# Altium project Simple_EEM_Controller.PrjPCB (part 2 of 5)

## Sheet Connector_EEM.SchDoc: =SheetTitle_Top
size 420 x 297 mm; EDA_Number: ARTIQ; Projet: Simple EEM Controller; Author: G.Kasprowicz; CompanyName: WUT ISE; DrawnBy: G.Kasprowicz; Organization: WUT ISE; Address1: PW ISE; Address2: Nowowiejska 15/19 00-665 Warsaw; Address3: gkasprow@gmail.com; Revision: 1.0; ModifiedBy: -; CheckedDate: -; Title2: EEM Connectors; DivGrp: WUT ISE; Designer: G.Kasprowicz; ModifiedDate: -; ProjectName: Sensor Box
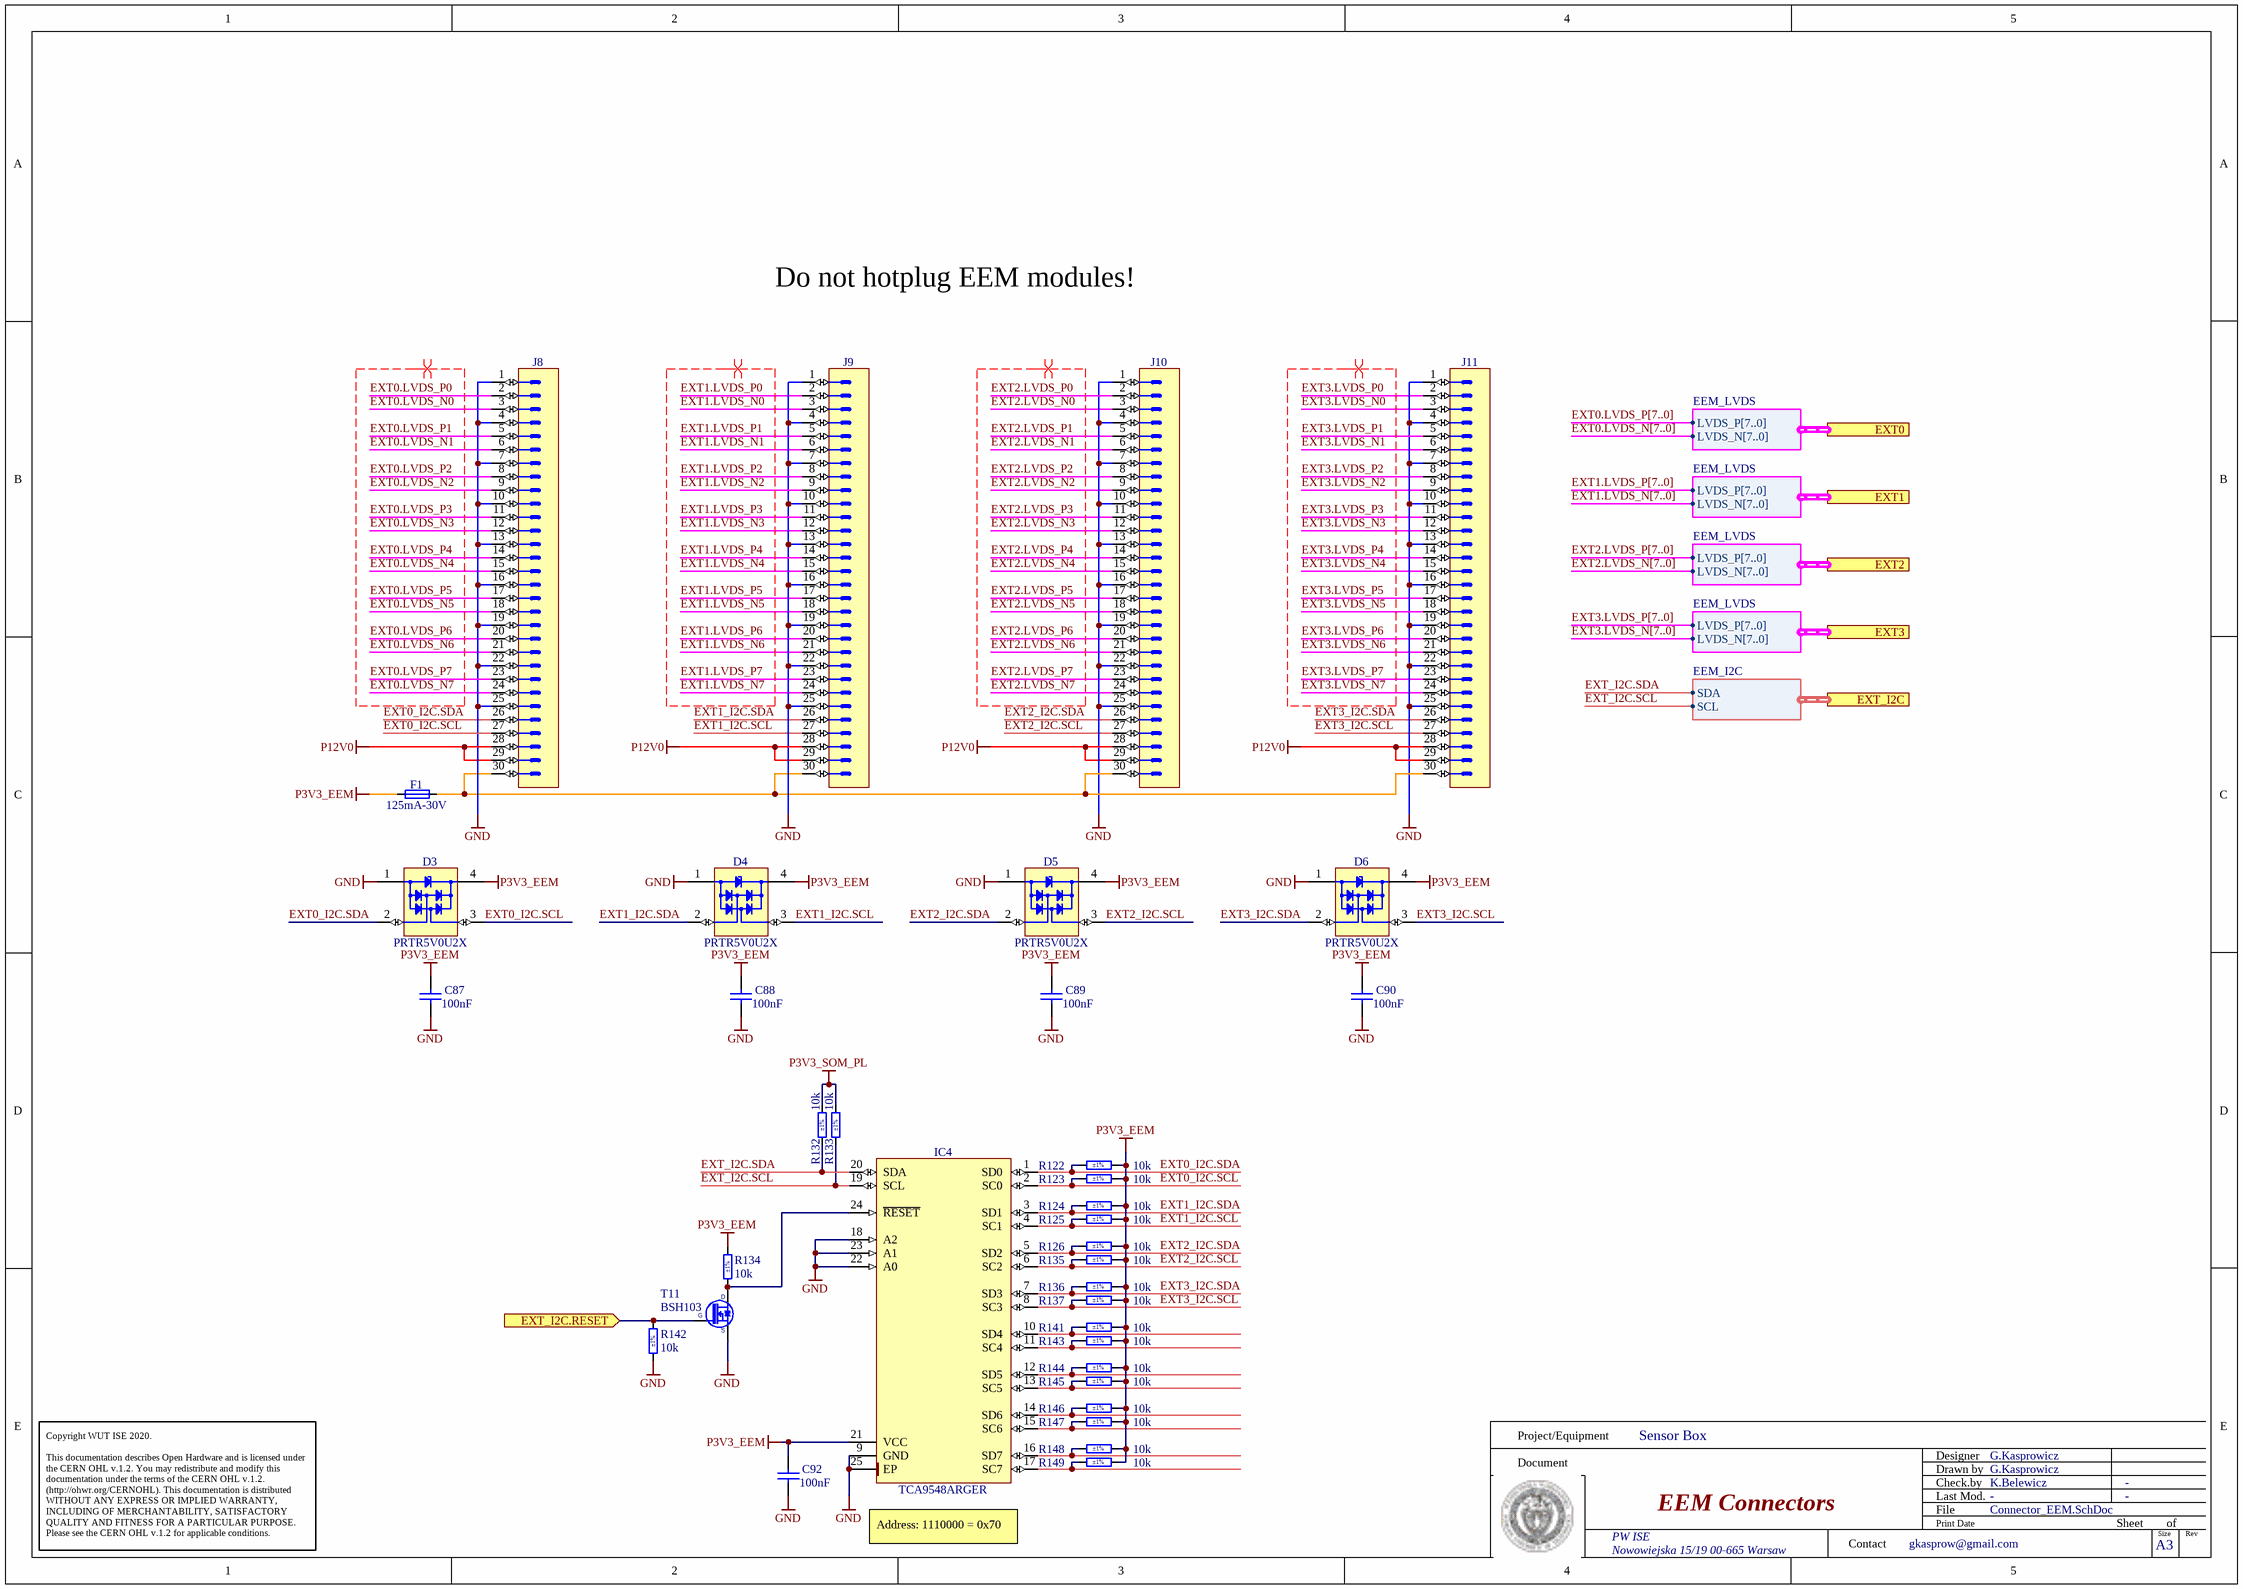
[diagram p3: Connector_EEM.SchDoc]

### Parts
C87  100nF  [CAPC1005X55N]
C88  100nF  [CAPC1005X55N]
C89  100nF  [CAPC1005X55N]
C90  100nF  [CAPC1005X55N]
C92  100nF  [CAPC1005X55N]
D3  PRTR5V0U2X  [SOT190P230X110-4N]
D4  PRTR5V0U2X  [SOT190P230X110-4N]
D5  PRTR5V0U2X  [SOT190P230X110-4N]
D6  PRTR5V0U2X  [SOT190P230X110-4N]
F1  125mA-30V  [FUSR_LITTELFUSE_1206L012]
IC4  TCA9548ARGER  [QFN50P400X400X100-25N-S220]
J8  (no value)  [3M_N2530-6002RB]
J9  (no value)  [3M_N2530-6002RB]
J10  (no value)  [3M_N2530-6002RB]
J11  (no value)  [3M_N2530-6002RB]
R122  10k  Tolerance: ±1%  [RESC1005X40N]
R123  10k  Tolerance: ±1%  [RESC1005X40N]
R124  10k  Tolerance: ±1%  [RESC1005X40N]
R125  10k  Tolerance: ±1%  [RESC1005X40N]
R126  10k  Tolerance: ±1%  [RESC1005X40N]
R132  10k  Tolerance: ±1%  [RESC1005X40N]
R133  10k  Tolerance: ±1%  [RESC1005X40N]
R134  10k  Tolerance: ±1%  [RESC1005X40N]
R135  10k  Tolerance: ±1%  [RESC1005X40N]
R136  10k  Tolerance: ±1%  [RESC1005X40N]
R137  10k  Tolerance: ±1%  [RESC1005X40N]
R141  10k  Tolerance: ±1%  [RESC1005X40N]
R142  10k  Tolerance: ±1%  [RESC1005X40N]
R143  10k  Tolerance: ±1%  [RESC1005X40N]
R144  10k  Tolerance: ±1%  [RESC1005X40N]
R145  10k  Tolerance: ±1%  [RESC1005X40N]
R146  10k  Tolerance: ±1%  [RESC1005X40N]
R147  10k  Tolerance: ±1%  [RESC1005X40N]
R148  10k  Tolerance: ±1%  [RESC1005X40N]
R149  10k  Tolerance: ±1%  [RESC1005X40N]
T11  BSH103  [SOT95P230X110-3N]

### Ports
EXT0 (harness EEM_LVDS), EXT1 (harness EEM_LVDS), EXT2 (harness EEM_LVDS), EXT3 (harness EEM_LVDS), EXT_I2C (harness EEM_I2C), EXT_I2C.RESET (in)

### Harnesses
EEM_LVDS: LVDS_N[7..0], LVDS_P[7..0]
EEM_I2C: SCL, SDA

### Nets
GND: C87.1 C88.1 C89.1 C90.1 C92.1 D3.1(GND) D4.1(GND) D5.1(GND) D6.1(GND) IC4.9(GND) IC4.18(A2) IC4.22(A0) IC4.23(A1) IC4.25(EP) J8.1 J8.4 J8.7 J8.10 J8.13 J8.16 J8.19 J8.22 J8.25 J9.1 J9.4 J9.7 J9.10 J9.13 J9.16 J9.19 J9.22 J9.25 J10.1 J10.4 J10.7 J10.10 J10.13 J10.16 J10.19 J10.22 J10.25 J11.1 J11.4 J11.7 J11.10 J11.13 J11.16 J11.19 J11.22 J11.25 R142.1 T11.2(S)
P3V3_EEM: C87.2 C88.2 C89.2 C90.2 C92.2 D3.4(VCC) D4.4(VCC) D5.4(VCC) D6.4(VCC) F1.1 IC4.21(VCC) R122.2 R123.2 R124.2 R125.2 R126.2 R134.2 R135.2 R136.2 R137.2 R141.2 R143.2 R144.2 R145.2 R146.2 R147.2 R148.2 R149.2
P3V3_SOM_PL: R132.2 R133.2
P12V0: J8.28 J8.29 J9.28 J9.29 J10.28 J10.29 J11.28 J11.29
EXT0.LVDS_N0: J8.3
EXT0.LVDS_N1: J8.6
EXT0.LVDS_N2: J8.9
EXT0.LVDS_N3: J8.12
EXT0.LVDS_N4: J8.15
EXT0.LVDS_N5: J8.18
EXT0.LVDS_N6: J8.21
EXT0.LVDS_N7: J8.24
EXT0.LVDS_P0: J8.2
EXT0.LVDS_P1: J8.5
EXT0.LVDS_P2: J8.8
EXT0.LVDS_P3: J8.11
EXT0.LVDS_P4: J8.14
EXT0.LVDS_P5: J8.17
EXT0.LVDS_P6: J8.20
EXT0.LVDS_P7: J8.23
EXT0_I2C.SCL: D3.3(I/O2) IC4.2(SC0) J8.27 R123.1
EXT0_I2C.SDA: D3.2(I/O1) IC4.1(SD0) J8.26 R122.1
EXT1.LVDS_N0: J9.3
EXT1.LVDS_N1: J9.6
EXT1.LVDS_N2: J9.9
EXT1.LVDS_N3: J9.12
EXT1.LVDS_N4: J9.15
EXT1.LVDS_N5: J9.18
EXT1.LVDS_N6: J9.21
EXT1.LVDS_N7: J9.24
EXT1.LVDS_P0: J9.2
EXT1.LVDS_P1: J9.5
EXT1.LVDS_P2: J9.8
EXT1.LVDS_P3: J9.11
EXT1.LVDS_P4: J9.14
EXT1.LVDS_P5: J9.17
EXT1.LVDS_P6: J9.20
EXT1.LVDS_P7: J9.23
EXT1_I2C.SCL: D4.3(I/O2) IC4.4(SC1) J9.27 R125.1
EXT1_I2C.SDA: D4.2(I/O1) IC4.3(SD1) J9.26 R124.1
EXT2.LVDS_N0: J10.3
EXT2.LVDS_N1: J10.6
EXT2.LVDS_N2: J10.9
EXT2.LVDS_N3: J10.12
EXT2.LVDS_N4: J10.15
EXT2.LVDS_N5: J10.18
EXT2.LVDS_N6: J10.21
EXT2.LVDS_N7: J10.24
EXT2.LVDS_P0: J10.2
EXT2.LVDS_P1: J10.5
EXT2.LVDS_P2: J10.8
EXT2.LVDS_P3: J10.11
EXT2.LVDS_P4: J10.14
EXT2.LVDS_P5: J10.17
EXT2.LVDS_P6: J10.20
EXT2.LVDS_P7: J10.23
EXT2_I2C.SCL: D5.3(I/O2) IC4.6(SC2) J10.27 R135.1
EXT2_I2C.SDA: D5.2(I/O1) IC4.5(SD2) J10.26 R126.1
EXT3.LVDS_N0: J11.3
EXT3.LVDS_N1: J11.6
EXT3.LVDS_N2: J11.9
EXT3.LVDS_N3: J11.12
EXT3.LVDS_N4: J11.15
EXT3.LVDS_N5: J11.18
EXT3.LVDS_N6: J11.21
EXT3.LVDS_N7: J11.24
EXT3.LVDS_P0: J11.2
EXT3.LVDS_P1: J11.5
EXT3.LVDS_P2: J11.8
EXT3.LVDS_P3: J11.11
EXT3.LVDS_P4: J11.14
EXT3.LVDS_P5: J11.17
EXT3.LVDS_P6: J11.20
EXT3.LVDS_P7: J11.23
EXT3_I2C.SCL: D6.3(I/O2) IC4.8(SC3) J11.27 R137.1
EXT3_I2C.SDA: D6.2(I/O1) IC4.7(SD3) J11.26 R136.1
EXT_I2C.RESET: R142.2 T11.1(G) ; port EXT_I2C.RESET
EXT_I2C.SCL: IC4.19(SCL) R133.1 ; port EXT_I2C.SCL
EXT_I2C.SDA: IC4.20(SDA) R132.1 ; port EXT_I2C.SDA
NetF1_2: F1.2 J8.30 J9.30 J10.30 J11.30
NetIC4_10: IC4.10(SD4) R141.1
NetIC4_11: IC4.11(SC4) R143.1
NetIC4_12: IC4.12(SD5) R144.1
NetIC4_13: IC4.13(SC5) R145.1
NetIC4_14: IC4.14(SD6) R146.1
NetIC4_15: IC4.15(SC6) R147.1
NetIC4_16: IC4.16(SD7) R148.1
NetIC4_17: IC4.17(SC7) R149.1
NetIC4_24: IC4.24(~{RESET}) R134.1 T11.3(D)

### Buses and harness runs
bus EXT0.LVDS_N[7..0]
bus EXT0.LVDS_P[7..0]
bus EXT1.LVDS_N[7..0]
bus EXT1.LVDS_P[7..0]
bus EXT2.LVDS_N[7..0]
bus EXT2.LVDS_P[7..0]
bus EXT3.LVDS_N[7..0]
bus EXT3.LVDS_P[7..0]

### Layout directives
differential pair: EXT0.LVDS_N0, EXT0.LVDS_N1, EXT0.LVDS_N2, EXT0.LVDS_N3, EXT0.LVDS_N4, EXT0.LVDS_N5, EXT0.LVDS_N6, EXT0.LVDS_N7, EXT0.LVDS_P0, EXT0.LVDS_P1, EXT0.LVDS_P2, EXT0.LVDS_P3, EXT0.LVDS_P4, EXT0.LVDS_P5, EXT0.LVDS_P6, EXT0.LVDS_P7, EXT1.LVDS_N0, EXT1.LVDS_N1, EXT1.LVDS_N2, EXT1.LVDS_N3, EXT1.LVDS_N4, EXT1.LVDS_N5, EXT1.LVDS_N6, EXT1.LVDS_N7, EXT1.LVDS_P0, EXT1.LVDS_P1, EXT1.LVDS_P2, EXT1.LVDS_P3, EXT1.LVDS_P4, EXT1.LVDS_P5, EXT1.LVDS_P6, EXT1.LVDS_P7, EXT2.LVDS_N0, EXT2.LVDS_N1, EXT2.LVDS_N2, EXT2.LVDS_N3, EXT2.LVDS_N4, EXT2.LVDS_N5, EXT2.LVDS_N6, EXT2.LVDS_N7, EXT2.LVDS_P0, EXT2.LVDS_P1, EXT2.LVDS_P2, EXT2.LVDS_P3, EXT2.LVDS_P4, EXT2.LVDS_P5, EXT2.LVDS_P6, EXT2.LVDS_P7, EXT3.LVDS_N0, EXT3.LVDS_N1, EXT3.LVDS_N2, EXT3.LVDS_N3, EXT3.LVDS_N4, EXT3.LVDS_N5, EXT3.LVDS_N6, EXT3.LVDS_N7, EXT3.LVDS_P0, EXT3.LVDS_P1, EXT3.LVDS_P2, EXT3.LVDS_P3, EXT3.LVDS_P4, EXT3.LVDS_P5, EXT3.LVDS_P6, EXT3.LVDS_P7

### Notes on the sheet
- Do not hotplug EEM modules!
- (near IC4) Address: 1110000 = 0x70
- Project/Equipment
- Document
- Designer
- Drawn by
- Check.by
- Copyright WUT ISE 2020.
  This documentation describes Open Hardware and is licensed under the CERN OHL v.1.2. You may redistribute and modify this documentation under the terms of the CERN OHL v.1.2. (http://ohwr.org/CERNOHL). This documentation is distributed WITHOUT ANY EXPRESS OR IMPLIED WARRANTY, INCLUDING OF MERCHANTABILITY, SATISFACTORY QUALITY AND FITNESS FOR A PARTICULAR PURPOSE. Please see the CERN OHL v.1.2 for applicable conditions.
- Contact
- File
- Last Mod.
- Print Date
- Sheet
- Size
- A3
- of
- Rev

### Library data of the parts
C87-C90 C92 = CC0402_100NF_16V_10%_X5R: Non-polarised capacitor; Part Description: SMD Multilayer Chip Ceramic Capacitor; Manufacturer: GENERIC; Manufacturer1 Part Number: GRM155R61C104KA88D; Voltage: 16V; TC: X5R; Tolerance: ±10%; Part Number: CC0402_100NF_16V_10%_X5R; Component Kind: Standard; Component Type: Standard; Pin Count: 2; Value: 100nF; Status: None; Manufacturer Part Number: CC0402_100NF_16V_10%_X5R; Case: 0402; Mounted: Yes; Socket: No; SMD: Yes; Sense: No; Manufacturer1 Example: MURATA; Manufacturer1 ComponentHeight: 0.55mm; HelpURL: \\cern.ch\dfs\Applications\Altium\Datasheets\CC0402_X5R_MURATA_GRM.pdf; Author: CERN DEM JLC; CreateDate: 10.12.2013; LatestRevisionDate: 10.12.2013
D3-D6 = PRTR5V0U2X: Ultra Low Capacitance Double Rail-to-Rail ESD Protection Diode; Part Description: Ultra Low Capacitance (1pF) Double Rail-to-Rail ESD Protection Diode (8kV); Manufacturer: NXP SEMICONDUCTORS; Voltage: 5.5V; PressFit: No; Bonding: No; Part Number: PRTR5V0U2X; Component Kind: Standard; Component Type: Standard; Device: PRTR5V0U2X; PackageDescription: SOT143B, SOT, 1.90mm Pitch; 4 Pin, 1.30mm W X 2.90mm L X 1.10mm H body, IPC Medium Density; Manufacturer Part Number: PRTR5V0U2X; Pin Count: 4; Case: SOT143B; Mounted: Yes; Socket: No; SMD: Yes; Sense: No; ComponentHeight: 1.1mm; HelpURL: \\cern.ch\dfs\Applications\Altium\Datasheets\PRTR5V0U2X.pdf; Author: CERN DEM JLC; CreateDate: 22.03.2011; LatestRevisionDate: 22.03.2011
F1 = FUSR_LITTELFUSE_1206L012: Fuse; Part Description: POLYFUSE® Surface Mount Resettable PTC; Manufacturer Part Number: 1206L012WR; PressFit: No; Part Number: FUSR_LITTELFUSE_1206L012; Component Kind: Standard; Component Type: Standard; Pin Count: 2; PackageDescription: Surface Mount POLY-FUSE® Resettable PTC, 1206L Series; Family: Fuses Resettable; Mounted: Yes; Socket: No; SMD: Yes; Sense: No; Value: 125mA-30V; Manufacturer: LITTELFUSE; ComponentHeight: 1.45mm; HelpURL: \\cern.ch\dfs\Applications\Altium\Datasheets\FUSR_LITTELFUSE_1206L012.pdf; Author: CERN DEM JLC; CreateDate: 19.12.2011; LatestRevisionDate: 19.12.2011
IC4 = TCA9548ARGER: Low Voltage 8-Channel I2C Switch With Reset; Manufacturer: TEXAS INSTRUMENTS; PressFit: No; Bonding: No; Part Number: TCA9548ARGER; Component Kind: Standard; Component Type: Standard; Device: TCA9548ARGER; PackageDescription: QFN, 0.50mm Pitch, Square; 24 Pin, 4.00mm L X 4.00mm W X 1.00mm H body (w/thermal tab 2.2 X 2.2mm), IPC Medium Density; Part Description: Low Voltage 8-Channel I2C Switch With Reset; Manufacturer Part Number: TCA9548ARGER; Pin Count: 25; Case: QFN24; Mounted: Yes; Socket: No; SMD: Yes; Sense: No; ComponentHeight: 1mm; Author: CERN DEM JLC; HelpURL: \\cern.ch\dfs\Applications\Altium\Datasheets\TCA9548ARGER.pdf; CreateDate: 07.07.2014; LatestRevisionDate: 07.07.2014
J8-J11 = 3M_N2530-6002RB: Connector 30 Male; Part Description: 30 Contacts - Straight .100'' x .100'' Low Profile Four-Wall Header, 2500 Series; Manufacturer: 3M; PressFit: No; Part Number: 3M_N2530-6002RB; Component Kind: Standard; Component Type: Standard; Pin Count: 30; Family: Header 30; Mounted: Yes; Socket: No; SMD: No; Sense: No; Status: None; Manufacturer Part Number: N2530-6002RB; ComponentHeight: 10.03mm; HelpURL: \\cern.ch\dfs\Applications\Altium\Datasheets\3M_N2530-6002RB.pdf; Author: CERN DEM JLC; CreateDate: 11.02.2009; LatestRevisionDate: 11.08.2009
R122-R126 R132-R137 R141-R149 = R0402_10K_1%_0.0625W_100PPM: Resistor - 1%; Part Description: General Purpose Thick Film Chip Resistor; Manufacturer: GENERIC; Manufacturer1 Part Number: 232270671003L; TC: ±100ppm/°C; PressFit: No; Part Number: R0402_10K_1%_0.0625W_100PPM; Component Kind: Standard; Component Type: Standard; Pin Count: 2; Value: 10k; Status: Not Recommended; Power: 0.0625W; Manufacturer Part Number: R0402_10K_1%_0.0625W_100PPM; Case: 0402; Mounted: Yes; Sense: No; Socket: No; SMD: Yes; Manufacturer1 Example: YAGEO PHYCOMP; Manufacturer1 ComponentHeight: 0.4mm; HelpURL: \\cern.ch\dfs\Applications\Altium\Datasheets\R0402_Phycomp_RC0402.pdf; Author: CERN DEM JLC; CreateDate: 03.12.2007; LatestRevisionDate: 17.10.2012
T11 = BSH103: N-CHANNEL MOSFET WITH DIODE; Part Description: 30V 850mA N-Channel Enhancement Mode Field-Effect Transistor; Manufacturer: NEXPERIA; PressFit: No; Bonding: No; Part Number: BSH103; Component Kind: Standard; Component Type: Standard; Device: BSH103; PackageDescription: SOT23, 3 pin, Pitch 0.95mm - 1.3mm W X 2.9mm L X 1.1mm H, IPC Medium Density; Manufacturer Part Number: BSH103; Pin Count: 3; Case: SOT23-3; Mounted: Yes; Socket: No; SMD: Yes; Sense: No; ComponentHeight: 1.1mm; HelpURL: \\cern.ch\dfs\Applications\Altium\Datasheets\BSH103.pdf; Author: CERN DEM JLC; CreateDate: 16.03.2010; LatestRevisionDate: 20.06.2017; ClassName: Artix

## Sheet SOM.SchDoc: =SheetTitle_Top
size 420 x 297 mm; EDA_Number: ARTIQ; Projet: Simple EEM Controller; Author: G.Kasprowicz; CompanyName: WUT ISE; DrawnBy: G.Kasprowicz; Organization: WUT ISE; Address1: PW ISE; Address2: Nowowiejska 15/19 00-665 Warsaw; Address3: gkasprow@gmail.com; Revision: 1.0; ModifiedBy: -; CheckedDate: -; Title2: SOM; DivGrp: WUT ISE; Designer: G.Kasprowicz; ModifiedDate: -; ProjectName: Sensor Box
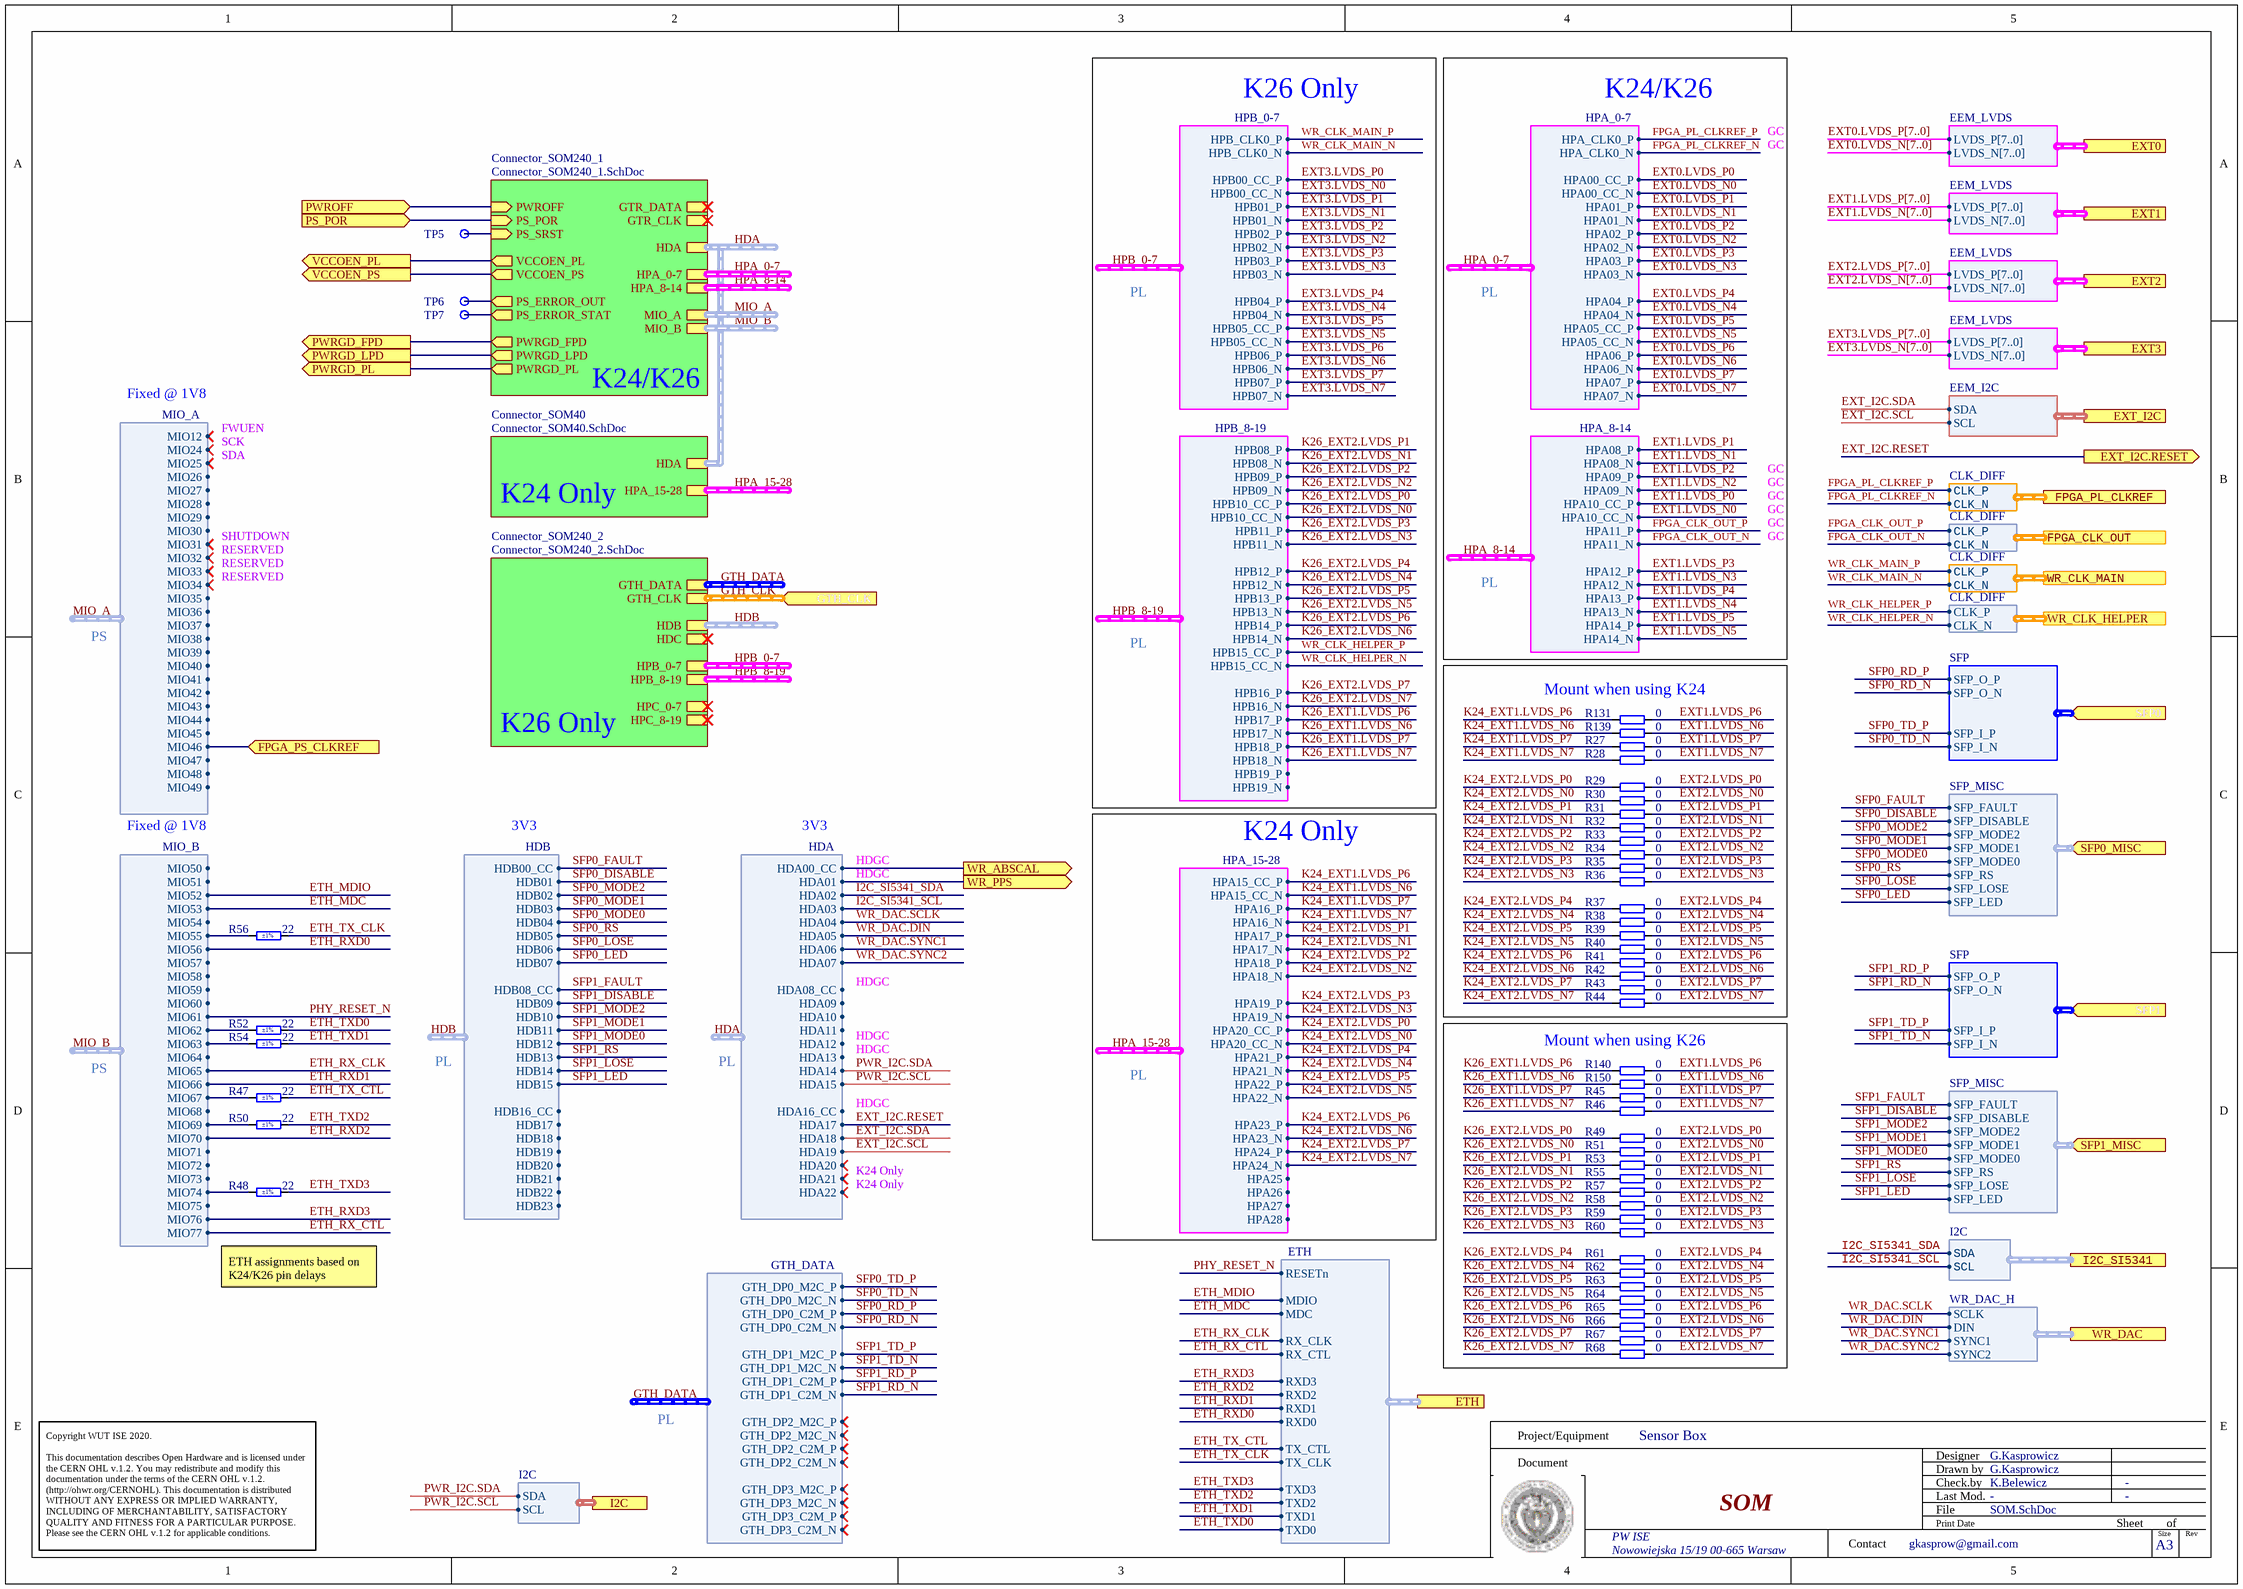
[diagram p4: SOM.SchDoc]

### Parts
(Parts that share a designator on the sheet are numbered #1, #2 ... from top to bottom, then left to right.)
R27  0  [RESC1005X40N]
R28  0  [RESC1005X40N]
R29  0  [RESC1005X40N]
R30  0  [RESC1005X40N]
R31  0  [RESC1005X40N]
R32  0  [RESC1005X40N]
R33  0  [RESC1005X40N]
R34  0  [RESC1005X40N]
R35  0  [RESC1005X40N]
R36  0  [RESC1005X40N]
R37  0  [RESC1005X40N]
R38  0  [RESC1005X40N]
R39  0  [RESC1005X40N]
R40  0  [RESC1005X40N]
R41  0  [RESC1005X40N]
R42  0  [RESC1005X40N]
R43  0  [RESC1005X40N]
R44  0  [RESC1005X40N]
R45  0  [RESC1005X40N]
R46  0  [RESC1005X40N]
R47  22  Tolerance: ±1%  [RESC1005X40N]
R48  22  Tolerance: ±1%  [RESC1005X40N]
R49  0  [RESC1005X40N]
R50  22  Tolerance: ±1%  [RESC1005X40N]
R51  0  [RESC1005X40N]
R52  22  Tolerance: ±1%  [RESC1005X40N]
R53  0  [RESC1005X40N]
R54  22  Tolerance: ±1%  [RESC1005X40N]
R55  0  [RESC1005X40N]
R56  22  Tolerance: ±1%  [RESC1005X40N]
R57  0  [RESC1005X40N]
R58  0  [RESC1005X40N]
R59  0  [RESC1005X40N]
R60  0  [RESC1005X40N]
R61  0  [RESC1005X40N]
R62  0  [RESC1005X40N]
R63  0  [RESC1005X40N]
R64  0  [RESC1005X40N]
R65  0  [RESC1005X40N]
R66  0  [RESC1005X40N]
R67  0  [RESC1005X40N]
R68  0  [RESC1005X40N]
R131  0  [RESC1005X40N]
R139#2  0  [RESC1005X40N]
R140#2  0  [RESC1005X40N]
R150  0  [RESC1005X40N]
TP5  Test Point  [TPS127]  (value not drawn)  (no BOM)
TP6  Test Point  [TPS127]  (value not drawn)  (no BOM)
TP7  Test Point  [TPS127]  (value not drawn)  (no BOM)

### Blocks framed on the sheet
Mount when using K24: R27-R44 R131 R139#2
Mount when using K26: R45 R46 R49 R51 R53 R55 R57-R68 R140#2 R150

### Sub-sheets
Connector_SOM40 = Connector_SOM40.SchDoc: HDA (harness HDA), HPA_15-28 (harness HPA_15-28)
Connector_SOM240_1 = Connector_SOM240_1.SchDoc: VCCOEN_PS (out), VCCOEN_PL (out), PS_ERROR_OUT (out), PS_ERROR_STAT (out), PWROFF (in), PS_POR (in), PS_SRST (in), PWRGD_FPD (out), PWRGD_LPD (out), PWRGD_PL (out), GTR_DATA (harness GTR_DATA), GTR_CLK (harness GTR_CLK), HDA (harness HDA), HPA_0-7 (harness HPA_0-7), HPA_8-14 (harness HPA_8-14), MIO_A (harness MIO_A), MIO_B (harness MIO_B)
Connector_SOM240_2 = Connector_SOM240_2.SchDoc: HDB (harness HDB), HDC (harness HDC), GTH_DATA (harness GTH_DATA), GTH_CLK (harness GTH_CLK), HPB_0-7 (harness HPB_0-7), HPB_8-19 (harness HPB_8-19), HPC_0-7 (harness HPC_0-7), HPC_8-19 (harness HPC_8-19)

### Ports
ETH (harness ETH), EXT0 (harness EEM_LVDS), EXT1 (harness EEM_LVDS), EXT2 (harness EEM_LVDS), EXT3 (harness EEM_LVDS), EXT_I2C (harness EEM_I2C), EXT_I2C.RESET (out), FPGA_CLK_OUT (harness CLK_DIFF), FPGA_PL_CLKREF (harness CLK_DIFF), FPGA_PS_CLKREF (in), GTH_CLK (in, harness GTH_CLK), I2C (harness I2C), I2C_SI5341 (harness I2C), PS_POR (in), PWRGD_FPD (out), PWRGD_LPD (out), PWRGD_PL (out), PWROFF (in), SFP0 (in, harness SFP), SFP0_MISC (in, harness SFP_MISC), SFP1 (in, harness SFP), SFP1_MISC (in, harness SFP_MISC), VCCOEN_PL (out), VCCOEN_PS (out), WR_ABSCAL (out), WR_CLK_HELPER (harness CLK_DIFF), WR_CLK_MAIN (harness CLK_DIFF), WR_DAC (harness WR_DAC_H), WR_PPS (out)

### Harnesses
SFP_MISC: SFP_FAULT, SFP_DISABLE, SFP_MODE2, SFP_MODE1, SFP_MODE0, SFP_RS, SFP_LOSE, SFP_LED
SFP: SFP_O_P, SFP_O_N, SFP_I_P, SFP_I_N
GTH_DATA: GTH_DP0_M2C_P, GTH_DP0_M2C_N, GTH_DP0_C2M_P, GTH_DP0_C2M_N, GTH_DP1_M2C_P, GTH_DP1_M2C_N, GTH_DP1_C2M_P, GTH_DP1_C2M_N, GTH_DP2_M2C_P, GTH_DP2_M2C_N, GTH_DP2_C2M_P, GTH_DP2_C2M_N, GTH_DP3_M2C_P, GTH_DP3_M2C_N, GTH_DP3_C2M_P, GTH_DP3_C2M_N
HPA_0-7: HPA_CLK0_P, HPA_CLK0_N, HPA00_CC_P, HPA00_CC_N, HPA01_P, HPA01_N, HPA02_P, HPA02_N, HPA03_P, HPA03_N, HPA04_P, HPA04_N, HPA05_CC_P, HPA05_CC_N, HPA06_P, HPA06_N, HPA07_P, HPA07_N
HPA_8-14: HPA08_P, HPA08_N, HPA09_P, HPA09_N, HPA10_CC_P, HPA10_CC_N, HPA11_P, HPA11_N, HPA12_P, HPA12_N, HPA13_P, HPA13_N, HPA14_P, HPA14_N
EEM_LVDS: LVDS_N[7..0], LVDS_P[7..0]
EEM_I2C: SCL, SDA
HPB_0-7: HPB_CLK0_P, HPB_CLK0_N, HPB00_CC_P, HPB00_CC_N, HPB01_P, HPB01_N, HPB02_P, HPB02_N, HPB03_P, HPB03_N, HPB04_P, HPB04_N, HPB05_CC_P, HPB05_CC_N, HPB06_P, HPB06_N, HPB07_P, HPB07_N
HPB_8-19: HPB08_P, HPB08_N, HPB09_P, HPB09_N, HPB10_CC_P, HPB10_CC_N, HPB11_P, HPB11_N, HPB12_P, HPB12_N, HPB13_P, HPB13_N, HPB14_P, HPB14_N, HPB15_CC_P, HPB15_CC_N, HPB16_P, HPB16_N, HPB17_P, HPB17_N, HPB18_P, HPB18_N, HPB19_P, HPB19_N
HPA_15-28: HPA15_CC_P, HPA15_CC_N, HPA16_P, HPA16_N, HPA17_P, HPA17_N, HPA18_P, HPA18_N, HPA19_P, HPA19_N, HPA20_CC_P, HPA20_CC_N, HPA21_P, HPA21_N, HPA22_P, HPA22_N, HPA23_P, HPA23_N, HPA24_P, HPA24_N, HPA25, HPA26, HPA27, HPA28
HDA: HDA00_CC, HDA01, HDA02, HDA03, HDA04, HDA06, HDA07, HDA05, HDA08_CC, HDA09, HDA10, HDA11, HDA12, HDA13, HDA14, HDA15, HDA16_CC, HDA17, HDA18, HDA19, HDA20, HDA21, HDA22
ETH: RXD3, RXD2, RX_CLK, RX_CTL, RXD1, RXD0, TX_CTL, TX_CLK, TXD3, TXD2, TXD1, TXD0, MDIO, MDC, RESETn
MIO_A: MIO12, MIO24, MIO25, MIO26, MIO27, MIO28, MIO29, MIO30, MIO31, MIO32, MIO33, MIO34, MIO35, MIO36, MIO37, MIO38, MIO39, MIO40, MIO41, MIO42, MIO43, MIO44, MIO45, MIO46, MIO47, MIO48, MIO49
CLK_DIFF: CLK_N, CLK_P
CLK_DIFF: CLK_P, CLK_N
I2C: SCL, SDA
WR_DAC_H: SYNC1, SCLK, SYNC2, DIN
HDB: HDB00_CC, HDB01, HDB02, HDB03, HDB04, HDB05, HDB06, HDB07, HDB08_CC, HDB09, HDB10, HDB11, HDB12, HDB13, HDB14, HDB15, HDB16_CC, HDB17, HDB18, HDB19, HDB20, HDB21, HDB22, HDB23
MIO_B: MIO50, MIO51, MIO52, MIO53, MIO54, MIO55, MIO56, MIO57, MIO58, MIO59, MIO60, MIO61, MIO62, MIO63, MIO64, MIO65, MIO66, MIO67, MIO68, MIO69, MIO70, MIO71, MIO72, MIO73, MIO74, MIO75, MIO76, MIO77

### Nets
ETH_MDC: port ETH.MDC, sheet Connector_SOM240_1/MIO_B.MIO53
ETH_MDIO: port ETH.MDIO, sheet Connector_SOM240_1/MIO_B.MIO52
ETH_RX_CLK: port ETH.RX_CLK, sheet Connector_SOM240_1/MIO_B.MIO65
ETH_RX_CTL: port ETH.RX_CTL, sheet Connector_SOM240_1/MIO_B.MIO77
ETH_RXD0: port ETH.RXD0, sheet Connector_SOM240_1/MIO_B.MIO56
ETH_RXD1: port ETH.RXD1, sheet Connector_SOM240_1/MIO_B.MIO66
ETH_RXD2: port ETH.RXD2, sheet Connector_SOM240_1/MIO_B.MIO70
ETH_RXD3: port ETH.RXD3, sheet Connector_SOM240_1/MIO_B.MIO76
ETH_TX_CLK: R56.2 ; port ETH.TX_CLK
ETH_TX_CTL: R47.2 ; port ETH.TX_CTL
ETH_TXD0: R52.2 ; port ETH.TXD0
ETH_TXD1: R54.2 ; port ETH.TXD1
ETH_TXD2: R50.2 ; port ETH.TXD2
ETH_TXD3: R48.2 ; port ETH.TXD3
EXT1.LVDS_N6: R139#2.2 R150.2
EXT1.LVDS_N7: R28.2 R46.2
EXT1.LVDS_P6: R131.2 R140#2.2
EXT1.LVDS_P7: R27.2 R45.2
EXT2.LVDS_N0: R30.2 R51.2
EXT2.LVDS_N1: R32.2 R55.2
EXT2.LVDS_N2: R34.2 R58.2
EXT2.LVDS_N3: R36.2 R60.2
EXT2.LVDS_N4: R38.2 R62.2
EXT2.LVDS_N5: R40.2 R64.2
EXT2.LVDS_N6: R42.2 R66.2
EXT2.LVDS_N7: R44.2 R68.2
EXT2.LVDS_P0: R29.2 R49.2
EXT2.LVDS_P1: R31.2 R53.2
EXT2.LVDS_P2: R33.2 R57.2
EXT2.LVDS_P3: R35.2 R59.2
EXT2.LVDS_P4: R37.2 R61.2
EXT2.LVDS_P5: R39.2 R63.2
EXT2.LVDS_P6: R41.2 R65.2
EXT2.LVDS_P7: R43.2 R67.2
EXT_I2C.RESET: port EXT_I2C.RESET, sheet Connector_SOM240_1/HDA.HDA17
EXT_I2C.SCL: port EXT_I2C.SCL, sheet Connector_SOM240_1/HDA.HDA19
EXT_I2C.SDA: port EXT_I2C.SDA, sheet Connector_SOM240_1/HDA.HDA18
FPGA_CLK_OUT_N: sheet Connector_SOM240_1/HPA_8-14.HPA11_N, port FPGA_CLK_OUT.CLK_N
FPGA_CLK_OUT_P: sheet Connector_SOM240_1/HPA_8-14.HPA11_P, port FPGA_CLK_OUT.CLK_P
FPGA_PL_CLKREF_N: sheet Connector_SOM240_1/HPA_0-7.HPA_CLK0_N, port FPGA_PL_CLKREF.CLK_N
FPGA_PL_CLKREF_P: sheet Connector_SOM240_1/HPA_0-7.HPA_CLK0_P, port FPGA_PL_CLKREF.CLK_P
HDA.HDA00_CC: port WR_ABSCAL, sheet Connector_SOM240_1/HDA.HDA00_CC
HDA.HDA01: port WR_PPS, sheet Connector_SOM240_1/HDA.HDA01
I2C_SI5341_SCL: sheet Connector_SOM240_1/HDA.HDA03, port I2C_SI5341.SCL  [project net HDA.HDA03]
I2C_SI5341_SDA: sheet Connector_SOM240_1/HDA.HDA02, port I2C_SI5341.SDA  [project net HDA.HDA02]
K24_EXT1.LVDS_N6: R139#2.1 ; sheet Connector_SOM40/HPA_15-28.HPA15_CC_N  [project net HPA15_CC_N]
K24_EXT1.LVDS_N7: R28.1 ; sheet Connector_SOM40/HPA_15-28.HPA16_N  [project net HPA16_N]
K24_EXT1.LVDS_P6: R131.1 ; sheet Connector_SOM40/HPA_15-28.HPA15_CC_P  [project net HPA15_CC_P]
K24_EXT1.LVDS_P7: R27.1 ; sheet Connector_SOM40/HPA_15-28.HPA16_P  [project net HPA16_P]
K24_EXT2.LVDS_N0: R30.1 ; sheet Connector_SOM40/HPA_15-28.HPA20_CC_N  [project net HPA20_CC_N]
K24_EXT2.LVDS_N1: R32.1 ; sheet Connector_SOM40/HPA_15-28.HPA17_N  [project net HPA17_N]
K24_EXT2.LVDS_N2: R34.1 ; sheet Connector_SOM40/HPA_15-28.HPA18_N  [project net HPA18_N]
K24_EXT2.LVDS_N3: R36.1 ; sheet Connector_SOM40/HPA_15-28.HPA19_N  [project net HPA19_N]
K24_EXT2.LVDS_N4: R38.1 ; sheet Connector_SOM40/HPA_15-28.HPA21_N  [project net HPA21_N]
K24_EXT2.LVDS_N5: R40.1 ; sheet Connector_SOM40/HPA_15-28.HPA22_N  [project net HPA22_N]
K24_EXT2.LVDS_N6: R42.1 ; sheet Connector_SOM40/HPA_15-28.HPA23_N  [project net HPA23_N]
K24_EXT2.LVDS_N7: R44.1 ; sheet Connector_SOM40/HPA_15-28.HPA24_N  [project net HPA24_N]
K24_EXT2.LVDS_P0: R29.1 ; sheet Connector_SOM40/HPA_15-28.HPA20_CC_P  [project net HPA20_CC_P]
K24_EXT2.LVDS_P1: R31.1 ; sheet Connector_SOM40/HPA_15-28.HPA17_P  [project net HPA17_P]
K24_EXT2.LVDS_P2: R33.1 ; sheet Connector_SOM40/HPA_15-28.HPA18_P  [project net HPA18_P]
K24_EXT2.LVDS_P3: R35.1 ; sheet Connector_SOM40/HPA_15-28.HPA19_P  [project net HPA19_P]
K24_EXT2.LVDS_P4: R37.1 ; sheet Connector_SOM40/HPA_15-28.HPA21_P  [project net HPA21_P]
K24_EXT2.LVDS_P5: R39.1 ; sheet Connector_SOM40/HPA_15-28.HPA22_P  [project net HPA22_P]
K24_EXT2.LVDS_P6: R41.1 ; sheet Connector_SOM40/HPA_15-28.HPA23_P  [project net HPA23_P]
K24_EXT2.LVDS_P7: R43.1 ; sheet Connector_SOM40/HPA_15-28.HPA24_P  [project net HPA24_P]
K26_EXT1.LVDS_N6: R150.1 ; sheet Connector_SOM240_2/HPB_8-19.HPB17_N  [project net HPB17_N]
K26_EXT1.LVDS_N7: R46.1 ; sheet Connector_SOM240_2/HPB_8-19.HPB18_N  [project net HPB18_N]
K26_EXT1.LVDS_P6: R140#2.1 ; sheet Connector_SOM240_2/HPB_8-19.HPB17_P  [project net HPB17_P]
K26_EXT1.LVDS_P7: R45.1 ; sheet Connector_SOM240_2/HPB_8-19.HPB18_P  [project net HPB18_P]
K26_EXT2.LVDS_N0: R51.1 ; sheet Connector_SOM240_2/HPB_8-19.HPB10_CC_N  [project net HPB10_CC_N]
K26_EXT2.LVDS_N1: R55.1 ; sheet Connector_SOM240_2/HPB_8-19.HPB08_N  [project net HPB08_N]
K26_EXT2.LVDS_N2: R58.1 ; sheet Connector_SOM240_2/HPB_8-19.HPB09_N  [project net HPB09_N]
K26_EXT2.LVDS_N3: R60.1 ; sheet Connector_SOM240_2/HPB_8-19.HPB11_N  [project net HPB11_N]
K26_EXT2.LVDS_N4: R62.1 ; sheet Connector_SOM240_2/HPB_8-19.HPB12_N  [project net HPB12_N]
K26_EXT2.LVDS_N5: R64.1 ; sheet Connector_SOM240_2/HPB_8-19.HPB13_N  [project net HPB13_N]
K26_EXT2.LVDS_N6: R66.1 ; sheet Connector_SOM240_2/HPB_8-19.HPB14_N  [project net HPB14_N]
K26_EXT2.LVDS_N7: R68.1 ; sheet Connector_SOM240_2/HPB_8-19.HPB16_N  [project net HPB16_N]
K26_EXT2.LVDS_P0: R49.1 ; sheet Connector_SOM240_2/HPB_8-19.HPB10_CC_P  [project net HPB10_CC_P]
K26_EXT2.LVDS_P1: R53.1 ; sheet Connector_SOM240_2/HPB_8-19.HPB08_P  [project net HPB08_P]
K26_EXT2.LVDS_P2: R57.1 ; sheet Connector_SOM240_2/HPB_8-19.HPB09_P  [project net HPB09_P]
K26_EXT2.LVDS_P3: R59.1 ; sheet Connector_SOM240_2/HPB_8-19.HPB11_P  [project net HPB11_P]
K26_EXT2.LVDS_P4: R61.1 ; sheet Connector_SOM240_2/HPB_8-19.HPB12_P  [project net HPB12_P]
K26_EXT2.LVDS_P5: R63.1 ; sheet Connector_SOM240_2/HPB_8-19.HPB13_P  [project net HPB13_P]
K26_EXT2.LVDS_P6: R65.1 ; sheet Connector_SOM240_2/HPB_8-19.HPB14_P  [project net HPB14_P]
K26_EXT2.LVDS_P7: R67.1 ; sheet Connector_SOM240_2/HPB_8-19.HPB16_P  [project net HPB16_P]
MIO46: port FPGA_PS_CLKREF, sheet Connector_SOM240_1/MIO_A.MIO46
MIO55: R56.1 ; sheet Connector_SOM240_1/MIO_B.MIO55
MIO62: R52.1 ; sheet Connector_SOM240_1/MIO_B.MIO62
MIO63: R54.1 ; sheet Connector_SOM240_1/MIO_B.MIO63
MIO67: R47.1 ; sheet Connector_SOM240_1/MIO_B.MIO67
MIO69: R50.1 ; sheet Connector_SOM240_1/MIO_B.MIO69
MIO74: R48.1 ; sheet Connector_SOM240_1/MIO_B.MIO74
PHY_RESET_N: port ETH.RESETn, sheet Connector_SOM240_1/MIO_B.MIO61  [project net MIO61]
PS_ERROR_OUT_M2C: TP6.1 ; sheet Connector_SOM240_1/PS_ERROR_OUT
PS_ERROR_STATUS_M2C: TP7.1 ; sheet Connector_SOM240_1/PS_ERROR_STAT
PS_POR: port PS_POR, sheet Connector_SOM240_1/PS_POR
PS_SRST_C2M: TP5.1 ; sheet Connector_SOM240_1/PS_SRST
PWR_I2C.SCL: sheet Connector_SOM240_1/HDA.HDA15, port I2C.SCL  [project net HDA.HDA15]
PWR_I2C.SDA: sheet Connector_SOM240_1/HDA.HDA14, port I2C.SDA  [project net HDA.HDA14]
PWRGD_FPD_M2C: port PWRGD_FPD, sheet Connector_SOM240_1/PWRGD_FPD
PWRGD_LPD_M2C: port PWRGD_LPD, sheet Connector_SOM240_1/PWRGD_LPD
PWRGD_PL_M2C: port PWRGD_PL, sheet Connector_SOM240_1/PWRGD_PL
PWROFF_C2M: port PWROFF, sheet Connector_SOM240_1/PWROFF
SFP0_DISABLE: port SFP0_MISC.SFP_DISABLE, sheet Connector_SOM240_2/HDB.HDB01  [project net HDB.HDB01]
SFP0_FAULT: port SFP0_MISC.SFP_FAULT, sheet Connector_SOM240_2/HDB.HDB00_CC  [project net HDB.HDB00_CC]
SFP0_LED: port SFP0_MISC.SFP_LED, sheet Connector_SOM240_2/HDB.HDB07  [project net HDB.HDB07]
SFP0_LOSE: port SFP0_MISC.SFP_LOSE, sheet Connector_SOM240_2/HDB.HDB06  [project net HDB.HDB06]
SFP0_MODE0: port SFP0_MISC.SFP_MODE0, sheet Connector_SOM240_2/HDB.HDB04  [project net HDB.HDB04]
SFP0_MODE1: port SFP0_MISC.SFP_MODE1, sheet Connector_SOM240_2/HDB.HDB03  [project net HDB.HDB03]
SFP0_MODE2: port SFP0_MISC.SFP_MODE2, sheet Connector_SOM240_2/HDB.HDB02  [project net HDB.HDB02]
SFP0_RD_N: port SFP0.SFP_O_N, sheet Connector_SOM240_2/GTH_DATA.GTH_DP0_C2M_N  [project net GTH_DATA.GTH_DP0_C2M_N]
SFP0_RD_P: port SFP0.SFP_O_P, sheet Connector_SOM240_2/GTH_DATA.GTH_DP0_C2M_P  [project net GTH_DATA.GTH_DP0_C2M_P]
SFP0_RS: port SFP0_MISC.SFP_RS, sheet Connector_SOM240_2/HDB.HDB05  [project net HDB.HDB05]
SFP0_TD_N: port SFP0.SFP_I_N, sheet Connector_SOM240_2/GTH_DATA.GTH_DP0_M2C_N  [project net GTH_DATA.GTH_DP0_M2C_N]
SFP0_TD_P: port SFP0.SFP_I_P, sheet Connector_SOM240_2/GTH_DATA.GTH_DP0_M2C_P  [project net GTH_DATA.GTH_DP0_M2C_P]
SFP1_DISABLE: port SFP1_MISC.SFP_DISABLE, sheet Connector_SOM240_2/HDB.HDB09  [project net HDB.HDB09]
SFP1_FAULT: port SFP1_MISC.SFP_FAULT, sheet Connector_SOM240_2/HDB.HDB08_CC  [project net HDB.HDB08_CC]
SFP1_LED: port SFP1_MISC.SFP_LED, sheet Connector_SOM240_2/HDB.HDB15  [project net HDB.HDB15]
SFP1_LOSE: port SFP1_MISC.SFP_LOSE, sheet Connector_SOM240_2/HDB.HDB14  [project net HDB.HDB14]
SFP1_MODE0: port SFP1_MISC.SFP_MODE0, sheet Connector_SOM240_2/HDB.HDB12  [project net HDB.HDB12]
SFP1_MODE1: port SFP1_MISC.SFP_MODE1, sheet Connector_SOM240_2/HDB.HDB11  [project net HDB.HDB11]
SFP1_MODE2: port SFP1_MISC.SFP_MODE2, sheet Connector_SOM240_2/HDB.HDB10  [project net HDB.HDB10]
SFP1_RD_N: port SFP1.SFP_O_N, sheet Connector_SOM240_2/GTH_DATA.GTH_DP1_C2M_N  [project net GTH_DATA.GTH_DP1_C2M_N]
SFP1_RD_P: port SFP1.SFP_O_P, sheet Connector_SOM240_2/GTH_DATA.GTH_DP1_C2M_P  [project net GTH_DATA.GTH_DP1_C2M_P]
SFP1_RS: port SFP1_MISC.SFP_RS, sheet Connector_SOM240_2/HDB.HDB13  [project net HDB.HDB13]
SFP1_TD_N: port SFP1.SFP_I_N, sheet Connector_SOM240_2/GTH_DATA.GTH_DP1_M2C_N  [project net GTH_DATA.GTH_DP1_M2C_N]
SFP1_TD_P: port SFP1.SFP_I_P, sheet Connector_SOM240_2/GTH_DATA.GTH_DP1_M2C_P  [project net GTH_DATA.GTH_DP1_M2C_P]
VCCOEN_PL_M2C: port VCCOEN_PL, sheet Connector_SOM240_1/VCCOEN_PL
VCCOEN_PS_M2C: port VCCOEN_PS, sheet Connector_SOM240_1/VCCOEN_PS
WR_CLK_HELPER_N: sheet Connector_SOM240_2/HPB_8-19.HPB15_CC_N, port WR_CLK_HELPER.CLK_N  [project net HPB15_CC_N]
WR_CLK_HELPER_P: sheet Connector_SOM240_2/HPB_8-19.HPB15_CC_P, port WR_CLK_HELPER.CLK_P  [project net HPB15_CC_P]
WR_CLK_MAIN_N: sheet Connector_SOM240_2/HPB_0-7.HPB_CLK0_N, port WR_CLK_MAIN.CLK_N  [project net HPB_0-7.HPB_CLK0_N]
WR_CLK_MAIN_P: sheet Connector_SOM240_2/HPB_0-7.HPB_CLK0_P, port WR_CLK_MAIN.CLK_P  [project net HPB_0-7.HPB_CLK0_P]
WR_DAC.DIN: sheet Connector_SOM240_1/HDA.HDA05, port WR_DAC.DIN  [project net HDA.HDA05]
WR_DAC.SCLK: sheet Connector_SOM240_1/HDA.HDA04, port WR_DAC.SCLK  [project net HDA.HDA04]
WR_DAC.SYNC1: sheet Connector_SOM240_1/HDA.HDA06, port WR_DAC.SYNC1  [project net HDA.HDA06]
WR_DAC.SYNC2: sheet Connector_SOM240_1/HDA.HDA07, port WR_DAC.SYNC2  [project net HDA.HDA07]

### Buses and harness runs
bus EXT0.LVDS_N[7..0]
bus EXT0.LVDS_P[7..0]
bus EXT1.LVDS_N[7..0]
bus EXT1.LVDS_P[7..0]
bus EXT2.LVDS_N[7..0]
bus EXT2.LVDS_P[7..0]
bus EXT3.LVDS_N[7..0]
bus EXT3.LVDS_P[7..0]
harness GTH_CLK = port GTH_CLK = sheet Connector_SOM240_2/GTH_CLK
harness GTH_DATA = sheet Connector_SOM240_2/GTH_DATA
harness HDA = sheet Connector_SOM40/HDA = sheet Connector_SOM240_1/HDA
harness HDB = sheet Connector_SOM240_2/HDB
harness HPA_0-7 = sheet Connector_SOM240_1/HPA_0-7
harness HPA_8-14 = sheet Connector_SOM240_1/HPA_8-14
harness HPA_15-28 = sheet Connector_SOM40/HPA_15-28
harness HPB_0-7 = sheet Connector_SOM240_2/HPB_0-7
harness HPB_8-19 = sheet Connector_SOM240_2/HPB_8-19
harness MIO_A = sheet Connector_SOM240_1/MIO_A
harness MIO_B = sheet Connector_SOM240_1/MIO_B

### Notes on the sheet
- K26 Only
- K24/K26
- GC
- PL
- Fixed @ 1V8
- FWUEN
- SCK
- SDA
- K24 Only
- RESERVED
- SHUTDOWN
- PS
- 3V3
- HDGC
- ETH assignments based on K24/K26 pin delays
- Project/Equipment
- Document
- Designer
- Drawn by
- Check.by
- Copyright WUT ISE 2020.
  This documentation describes Open Hardware and is licensed under the CERN OHL v.1.2. You may redistribute and modify this documentation under the terms of the CERN OHL v.1.2. (http://ohwr.org/CERNOHL). This documentation is distributed WITHOUT ANY EXPRESS OR IMPLIED WARRANTY, INCLUDING OF MERCHANTABILITY, SATISFACTORY QUALITY AND FITNESS FOR A PARTICULAR PURPOSE. Please see the CERN OHL v.1.2 for applicable conditions.
- Contact
- File
- Last Mod.
- Print Date
- Sheet
- Size
- A3
- of
- Rev

### Library data of the parts
R27-R46 R49 R51 R53 R55 R57-R68 R131 R139#2 R140#2 R150 = R0402_0R_JUMPER: Resistor; Part Description: 1A (0.05R Max DC Resistance) Zero Ohm Jumper; Manufacturer: GENERIC; Manufacturer1 Part Number: 232270591001L; PressFit: No; Part Number: R0402_0R_JUMPER; Component Kind: Standard; Component Type: Standard; Pin Count: 2; Value: 0; Status: Not Recommended; Manufacturer Part Number: R0402_0R_JUMPER; Case: 0402; Mounted: Yes; Sense: No; Socket: No; SMD: Yes; Manufacturer1 Example: YAGEO PHYCOMP; Manufacturer1 ComponentHeight: 0.4mm; HelpURL: \\cern.ch\dfs\Applications\Altium\Datasheets\R0402_Phycomp_RC0402.pdf; Author: CERN DEM JLC; CreateDate: 03.12.2007; LatestRevisionDate: 17.10.2012
R47 R48 R50 R52 R54 R56 = R0402_22R_1%_0.0625W_100PPM: Resistor - 1%; Part Description: General Purpose Thick Film Chip Resistor; Manufacturer: GENERIC; Manufacturer1 Part Number: 232270672209L; TC: ±100ppm/°C; PressFit: No; Part Number: R0402_22R_1%_0.0625W_100PPM; Component Kind: Standard; Component Type: Standard; Pin Count: 2; Value: 22; Status: Not Recommended; Power: 0.0625W; Manufacturer Part Number: R0402_22R_1%_0.0625W_100PPM; Case: 0402; Mounted: Yes; Sense: No; Socket: No; SMD: Yes; Manufacturer1 Example: YAGEO PHYCOMP; Manufacturer1 ComponentHeight: 0.4mm; HelpURL: \\cern.ch\dfs\Applications\Altium\Datasheets\R0402_Phycomp_RC0402.pdf; Author: CERN DEM JLC; CreateDate: 03.12.2007; LatestRevisionDate: 17.10.2012
TP5-TP7 = SMD_PAD_1.27X1.27MM: Part Description: 1.27mm x 1.27mm PCB Copper Area (SMD Test Point); Mounted: No; Part Number: SMD_PAD_1.27X1.27MM; Component Type: Standard (No BOM); Pin Count: 1; Family: Test Point; Socket: No; SMD: Yes; Sense: No; Status: None; ComponentHeight: 0mm; HelpURL: Undefined; Author: CERN DEM JLC; CreateDate: 12.01.2008; LatestRevisionDate: 12.01.2008; PackageDescription: 1.27mm x 1.27mm PCB Copper Area (SMD Test Point)